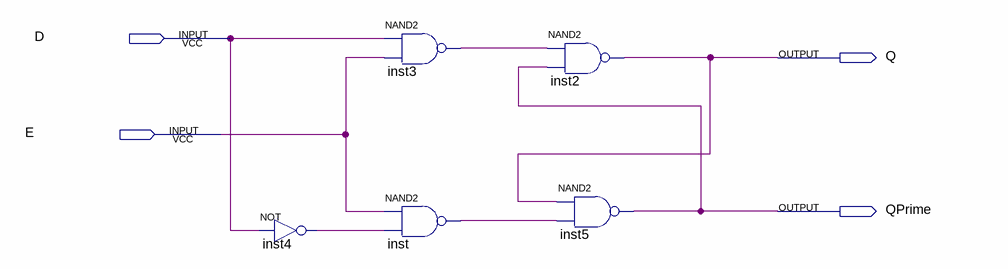
[diagram p0: schematic sheet]
// Quartus schematic dstylelatch.bdf as structural Verilog: 5 symbols, 4 pins
module dstylelatch (
  input  D,
  input  E,
  output Q,
  output QPrime
);

  wire inst3_out, inst4_out, inst_out;

  not inst4 (inst4_out, D);
  nand inst3 (inst3_out, D, E);
  nand inst (inst_out, E, inst4_out);
  nand inst2 (Q, inst3_out, QPrime);
  nand inst5 (QPrime, Q, inst_out);
endmodule
